# Altium schematic sheet Motor Driver.SchDoc: Motor Driver
size A4; SheetNumber: 1; SheetTotal: 4
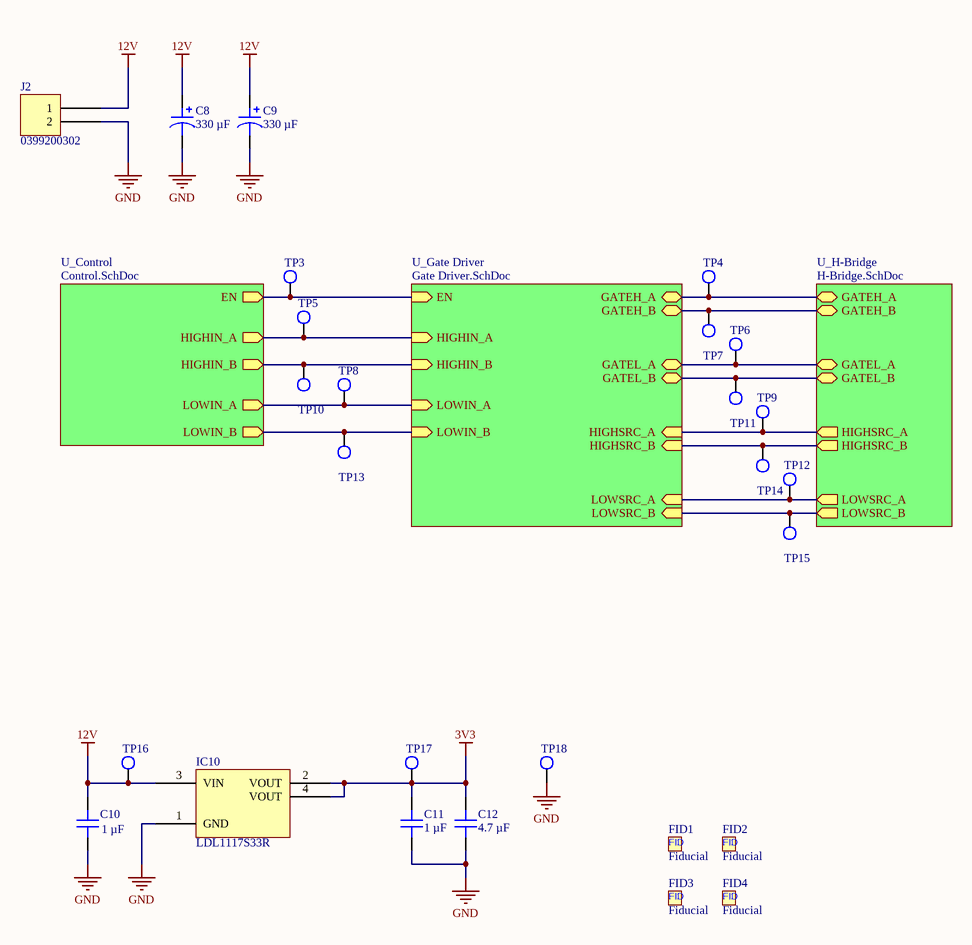
[diagram p0: Motor Driver.SchDoc]

## Parts
C8  330 µF  [CAP TH ALPOLY D10.00mm S5.00mm H13.50mm]
C9  330 µF  [CAP TH ALPOLY D10.00mm S5.00mm H13.50mm]
C10  1 µF  [CAP 0805_2012]
C11  1 µF  [CAP 0805_2012]
C12  4.7 µF  [CAP 0805_2012]
FID1  Fiducial  [Fiducial-1mm]
FID2  Fiducial  [Fiducial-1mm]
FID3  Fiducial  [Fiducial-1mm]
FID4  Fiducial  [Fiducial-1mm]
IC10  LDL1117S33R  [ST SOT-223]
J2  0399200302  [MOLEX 0399200302]
TP3  Test Point  [TestPoint-1.5mm]  (value not drawn)  (no BOM)
TP4  Test Point  [TestPoint-1.5mm]  (value not drawn)  (no BOM)
TP5  Test Point  [TestPoint-1.5mm]  (value not drawn)  (no BOM)
TP6  Test Point  [TestPoint-1.5mm]  (value not drawn)  (no BOM)
TP7  Test Point  [TestPoint-1.5mm]  (value not drawn)  (no BOM)
TP8  Test Point  [TestPoint-1.5mm]  (value not drawn)  (no BOM)
TP9  Test Point  [TestPoint-1.5mm]  (value not drawn)  (no BOM)
TP10  Test Point  [TestPoint-1.5mm]  (value not drawn)  (no BOM)
TP11  Test Point  [TestPoint-1.5mm]  (value not drawn)  (no BOM)
TP12  Test Point  [TestPoint-1.5mm]  (value not drawn)  (no BOM)
TP13  Test Point  [TestPoint-1.5mm]  (value not drawn)  (no BOM)
TP14  Test Point  [TestPoint-1.5mm]  (value not drawn)  (no BOM)
TP15  Test Point  [TestPoint-1.5mm]  (value not drawn)  (no BOM)
TP16  Test Point  [TestPoint-1.5mm]  (value not drawn)  (no BOM)
TP17  Test Point  [TestPoint-1.5mm]  (value not drawn)  (no BOM)
TP18  Test Point  [TestPoint-1.5mm]  (value not drawn)  (no BOM)

## Sub-sheets
U_Control = Control.SchDoc: HIGHIN_A (out), LOWIN_A (out), LOWIN_B (out), HIGHIN_B (out), EN (out)
U_Gate Driver = Gate Driver.SchDoc: HIGHIN_A (in), LOWIN_A (in), LOWIN_B (in), HIGHIN_B (in), HIGHSRC_A (in), HIGHSRC_B (in), LOWSRC_A (in), LOWSRC_B (in), GATEH_A (bidir), GATEH_B (bidir), GATEL_B (bidir), GATEL_A (bidir), EN (in)
U_H-Bridge = H-Bridge.SchDoc: HIGHSRC_A (out), HIGHSRC_B (out), LOWSRC_A (out), LOWSRC_B (out), GATEH_A (bidir), GATEH_B (bidir), GATEL_B (bidir), GATEL_A (bidir)

## Nets
3V3: C11.2 C12.2 IC10.2(VOUT) IC10.4(VOUT) TP17.1(TP)
12V: C8.1 C9.1 C10.2 IC10.3(VIN) J2.1 TP16.1(TP)
GND: C8.2 C9.2 C10.1 C11.1 C12.1 IC10.1(GND) J2.2 TP18.1(TP)
NetTP3_1: TP3.1(TP) ; sheet U_Gate Driver/EN, sheet U_Control/EN
NetTP4_1: TP4.1(TP) ; sheet U_Gate Driver/GATEH_A, sheet U_H-Bridge/GATEH_A
NetTP5_1: TP5.1(TP) ; sheet U_Gate Driver/HIGHIN_A, sheet U_Control/HIGHIN_A
NetTP6_1: TP6.1(TP) ; sheet U_Gate Driver/GATEL_A, sheet U_H-Bridge/GATEL_A
NetTP7_1: TP7.1(TP) ; sheet U_Gate Driver/GATEH_B, sheet U_H-Bridge/GATEH_B
NetTP8_1: TP8.1(TP) ; sheet U_Gate Driver/LOWIN_A, sheet U_Control/LOWIN_A
NetTP9_1: TP9.1(TP) ; sheet U_Gate Driver/HIGHSRC_A, sheet U_H-Bridge/HIGHSRC_A
NetTP10_1: TP10.1(TP) ; sheet U_Gate Driver/HIGHIN_B, sheet U_Control/HIGHIN_B
NetTP11_1: TP11.1(TP) ; sheet U_Gate Driver/GATEL_B, sheet U_H-Bridge/GATEL_B
NetTP12_1: TP12.1(TP) ; sheet U_Gate Driver/LOWSRC_A, sheet U_H-Bridge/LOWSRC_A
NetTP13_1: TP13.1(TP) ; sheet U_Gate Driver/LOWIN_B, sheet U_Control/LOWIN_B
NetTP14_1: TP14.1(TP) ; sheet U_Gate Driver/HIGHSRC_B, sheet U_H-Bridge/HIGHSRC_B
NetTP15_1: TP15.1(TP) ; sheet U_Gate Driver/LOWSRC_B, sheet U_H-Bridge/LOWSRC_B

## Notes on the sheet
- Title
- Size:
- Date:
- A4
- Number:
- Time:
- Revision:
- Sheet
- of
- File:
- (in symbol Fiducial) FID

## Library data of the parts
C8 C9 = 337AVG035MGBJ: CAP ALUM POLY 330UF 20% 35V T/H; manufacturer: Illinois Capacitor; ESR (Equivalent Series Resistance): 24mOhm; Lifetime @ Temp.: 1500 Hrs @ 125°C; Ripple Current @ High Frequency: 3.4 A @ 100 kHz; Ripple Current @ Low Frequency: 170 mA @ 120 Hz; Type: Polymer; Part Number: 337AVG035MGBJ; Value: 330 µF; Applications: General Purpose; Capacitance: 330 µF; componentlink1description: Datasheet; componentlink1url: http://www.illinoiscapacitor.com/pdf/seriesDocuments/AVG%20series.pdf; componentlink2description: DigiKey Link; componentlink2url: https://www.digikey.com/en/products/detail/illinois-capacitor/337AVG035MGBJ/5412303; Device Package: Radial, Can; Height - Seated (Max): 0.532" (13.50mm); lastupdated: 05/03/2022 17:42:14; Lead Spacing: 0.197" (5.00mm); Lifecycle Status: Active; Minimum Order: 1; Mounting Type: Through Hole; Operating Temperature: -55°C ~ 125°C; Package / Case: Radial, Can; packaging: Bulk; partid: 4548; Part Status: Active; price: 1.51; series: AVG; Size / Dimension: 0.394" Dia (10.00mm); Supplier 1: DigiKey; Supplier Part Number 1: 1572-1435-ND; Tolerance: ±20%; Voltage - Rated: 35 V
C10 C11 = 08055C105KAZ2A: CAP CER 1UF 50V X7R 0805; manufacturer: KYOCERA AVX; Tolerance: ±10%; Part Number: 08055C105KAZ2A; Value: 1 µF; Applications: Boardflex Sensitive; Capacitance: 1 µF; componentlink1description: Datasheet; componentlink1url: https://datasheets.kyocera-avx.com/FlexitermMLCC.pdf; componentlink2description: DigiKey Link; componentlink2url: https://www.digikey.com/en/products/detail/kyocera-avx/08055C105KAZ2A/11568641; Device Package: 0805 (2012 Metric); Features: Soft Termination; lastupdated: 05/03/2022 16:50:45; Lifecycle Status: Active; Minimum Order: 1; Mounting Type: Surface Mount, MLCC; Operating Temperature: -55°C ~ 125°C; Package / Case: 0805 (2012 Metric); packaging: TapeAndReel; partid: 33480; Part Status: Active; price: 0.06; series: -; Size / Dimension: 0.079" L x 0.049" W (2.01mm x 1.25mm); Supplier 1: DigiKey; Supplier Part Number 1: 478-08055C105KAZ2ACT-ND; Temperature Coefficient: X7R; Thickness (Max): 0.055" (1.40mm); Voltage - Rated: 50V
C12 = 885012107009: CAP CER 4.7UF 10V X5R 0805; manufacturer: Würth Elektronik; Tolerance: ±20%; Part Number: 885012107009; Value: 4.7 µF; Applications: General Purpose; Capacitance: 4.7 µF; componentlink1description: Datasheet; componentlink1url: https://katalog.we-online.de/pbs/datasheet/885012107009.pdf; componentlink2description: DigiKey Link; componentlink2url: https://www.digikey.com/en/products/detail/würth-elektronik/885012107009/5453474; Device Package: 0805 (2012 Metric); lastupdated: 05/03/2022 16:51:07; Lifecycle Status: Active; Minimum Order: 1; Mounting Type: Surface Mount, MLCC; Operating Temperature: -55°C ~ 85°C; Package / Case: 0805 (2012 Metric); packaging: TapeAndReel; partid: 14493; Part Status: Active; price: 0.09; series: WCAP-CSGP; Size / Dimension: 0.079" L x 0.049" W (2.00mm x 1.25mm); Supplier 1: DigiKey; Supplier Part Number 1: 732-7619-1-ND; Temperature Coefficient: X5R; Thickness (Max): 0.053" (1.35mm); Voltage - Rated: 10V
IC10 = LDL1117S33R: IC REG LINEAR 3.3V 1.2A SOT223; Manufacturer: STMicroelectronics; Current - Quiescent (Iq): 500 µA; Number of Regulators: 1; Output Configuration: Positive; Output Type: Fixed; Protection Features: Over Current, Over Temperature, Under Voltage Lockout (UVLO); PSRR: 87dB ~ 65dB (120Hz ~ 100kHz); Voltage Dropout (Max): 0.6V @ 1.2A; Voltage - Input (Max): 18V; Part Number: LDL1117S33R; ComponentLink1Description: Datasheet; ComponentLink1URL: http://www.st.com/content/ccc/resource/technical/document/datasheet/group3/0e/5a/00/ca/10/1a/4f/a5/DM00366442/files/DM00366442.pdf/jcr:content/translations/en.DM00366442.pdf; ComponentLink2Description: DigiKey Link; ComponentLink2URL: https://www.digikey.com/en/products/detail/stmicroelectronics/LDL1117S33R/7102071; Current - Output: 1.2A; LastUpdated: 05/03/2022 21:27:25; Lifecycle Status: Active; Minimum Order: 1; Mounting Type: Surface Mount; Operating Temperature: -40°C ~ 125°C (TJ); Package / Case: TO-261-4, TO-261AA; Packaging: TapeAndReel; Part Status: Active; Price: 0.14; Series: -; Supplier 1: DigiKey; Supplier Part Number 1: 497-17239-1-ND; Supplier Device Package: SOT-223; Voltage - Output (Min/Fixed): 3.3V
J2 = 0399200302: TERM BLK 2P SIDE ENTRY 15MM PCB; Manufacturer: Molex; Current: 115 A; Mating Orientation: Horizontal with Board; Number of Levels: 1; Pitch: 0.591" (15.00mm); Positions Per Level: 2; Voltage: 600 V; Wire Gauge: 1-8 AWG; Wire Termination: Screw - Rising Cage Clamp; Part Number: 0399200302; Color: Black; ComponentLink1Description: Datasheet; ComponentLink1URL: https://www.molex.com/pdm_docs/sd/399200302_sd.pdf; ComponentLink2Description: DigiKey Link; ComponentLink2URL: https://www.digikey.com/en/products/detail/molex/0399200302/3316297; LastUpdated: 05/03/2022 16:30:55; Lifecycle Status: Active; Minimum Order: 1; Mounting Type: Through Hole; Packaging: Bulk; Part Status: Active; Price: 5.90; Series: Eurostyle 39920; Supplier 1: DigiKey; Supplier Part Number 1: WM20114-ND